# Altium schematic sheet adc084s021.SchDoc
size A; DocumentNumber: 1; SheetNumber: 1; SheetTotal: 1
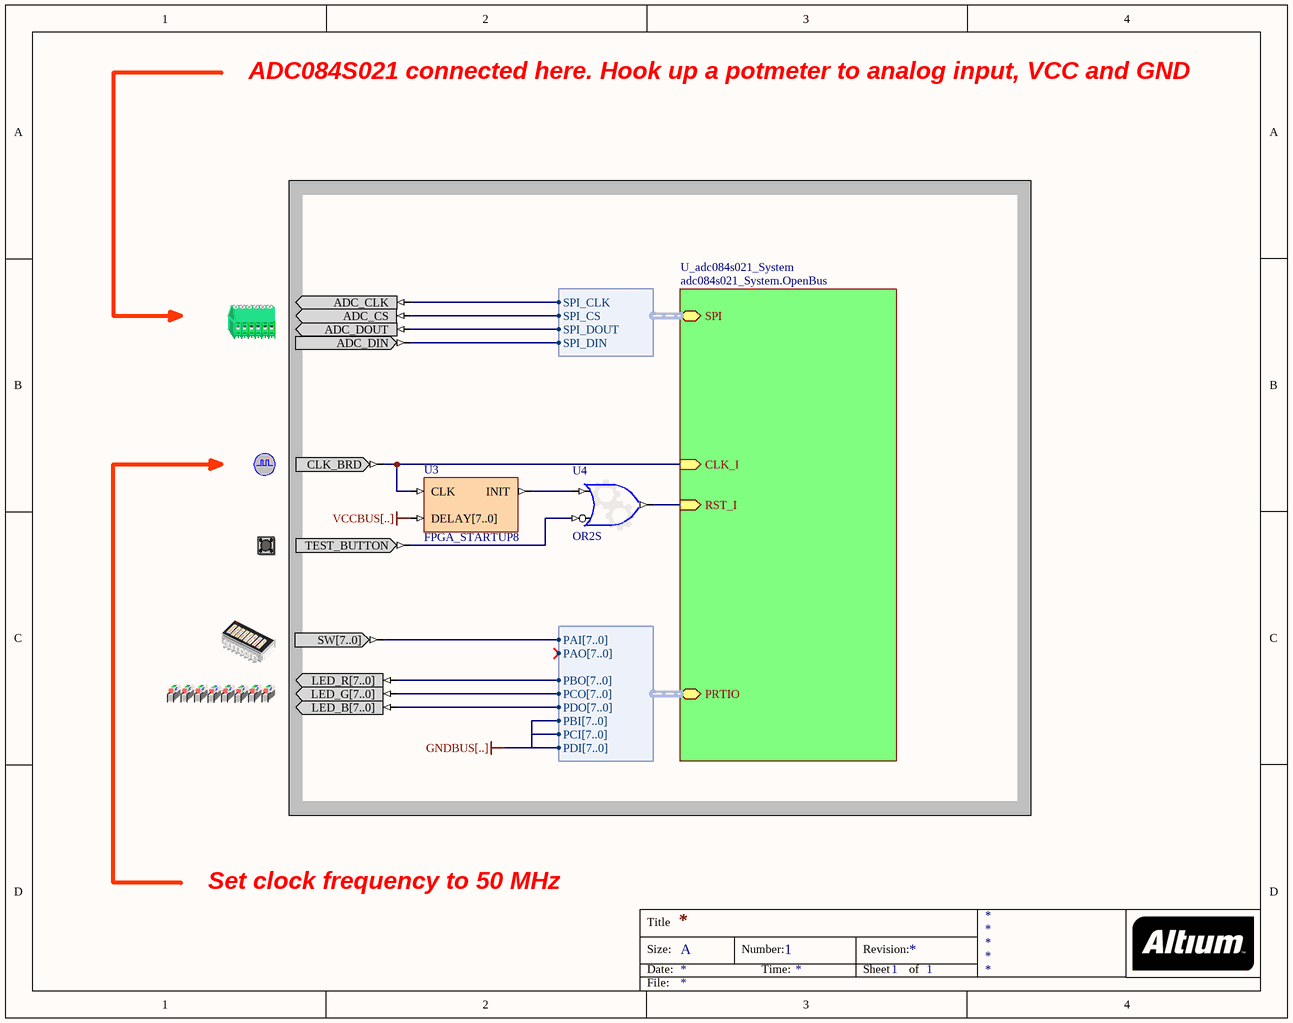
[diagram p0: adc084s021.SchDoc]

## Parts
(Parts that share a designator on the sheet are numbered #1, #2 ... from top to bottom, then left to right.)
?#1  ADC  (value not drawn)
?#2  CLOCK_BOARD  (value not drawn)
?#3  TEST_BUTTON  (value not drawn)
?#4  DIPSWITCH  (value not drawn)
?#5  LEDS_RGB  (value not drawn)
U3  FPGA_STARTUP8
U4  OR2S

## Sub-sheets
U_adc084s021_System = adc084s021_System.OpenBus: RST_I (in), CLK_I (in), PRTIO (harness WB_PRTIO_IO_4_8), SPI (harness SPI_W_NB)

## Harnesses
WB_PRTIO_IO_4_8: PAO[7..0], PAI[7..0], PBO[7..0], PBI[7..0], PCO[7..0], PCI[7..0], PDO[7..0], PDI[7..0]
SPI_W_NB: SPI_DOUT, SPI_DIN, SPI_CLK, SPI_CS

## Nets
VCCBUS[..]: U3.DELAY[7..0]
Net?#1_ADC_CLK: ?#1.ADC_CLK ; sheet U_adc084s021_System/SPI.SPI_CLK
Net?#1_ADC_CS: ?#1.ADC_CS ; sheet U_adc084s021_System/SPI.SPI_CS
Net?#1_ADC_DIN: ?#1.ADC_DIN ; sheet U_adc084s021_System/SPI.SPI_DIN
Net?#1_ADC_DOUT: ?#1.ADC_DOUT ; sheet U_adc084s021_System/SPI.SPI_DOUT
Net?#2_CLK_BRD: ?#2.CLK_BRD U3.CLK ; sheet U_adc084s021_System/CLK_I
Net?#3_TEST_BUTTON: ?#3.TEST_BUTTON U4.I1
Net?#4_SW[7..0]: ?#4.SW[7..0] ; sheet U_adc084s021_System/PRTIO.PAI[7..0]
Net?#5_LED_B[7..0]: ?#5.LED_B[7..0] ; sheet U_adc084s021_System/PRTIO.PDO[7..0]
Net?#5_LED_G[7..0]: ?#5.LED_G[7..0] ; sheet U_adc084s021_System/PRTIO.PCO[7..0]
Net?#5_LED_R[7..0]: ?#5.LED_R[7..0] ; sheet U_adc084s021_System/PRTIO.PBO[7..0]
NetU3_INIT: U3.INIT U4.I0
NetU4_O: U4.O ; sheet U_adc084s021_System/RST_I

## Notes on the sheet
- ADC084S021 connected here. Hook up a potmeter to analog input, VCC and GND
- Set clock frequency to 50 MHz
- Title
- Size:
- Date:
- A
- Number:
- Time:
- Revision:
- Sheet
- of
- File:
- (in symbol DIPSWITCH) ON; 1; 2; 3; 4; 5; 6; 7; 8

## Library data of the parts
?#1 = ADC: Digital Analog Converter; PortComponent: True; Published: 11-Mar-2009; Publisher: Altium Limited; HelpURL: https://wiki.altium.com/display/ADOH/NanoBoard+3000+-+ADC+Interface; UseInDSF: True
?#2 = CLOCK_BOARD: Global System Clock Supply; PortComponent: True; Published: 19-Nov-2003; Publisher: Altium Limited; HelpURL: https://wiki.altium.com/display/ADOH/NanoBoard+3000+-+System+Clocks; UseInDSF: True
?#3 = TEST_BUTTON: Test / Reset Button; PortComponent: True; Published: 19-Nov-2003; Publisher: Altium Limited; HelpURL: https://wiki.altium.com/display/ADOH/NanoBoard+3000+-+Test-Reset+Button
?#4 = DIPSWITCH: 8-Way Dip-Switch; PortComponent: True; Published: 19-Nov-2003; Publisher: Altium Limited; HelpURL: https://wiki.altium.com/display/ADOH/NanoBoard+3000+-+User+DIP-Switch
?#5 = LEDS_RGB: LEDS RGB; PortComponent: True; Published: 11-Mar-2009; Publisher: Altium Limited; HelpURL: https://wiki.altium.com/display/ADOH/NanoBoard+3000+-+RGB+User+LEDs
U3 = FPGA_STARTUP8: FPGA Startup With 8 Bit Delay; Published: 9-Dec-2004; Publisher: Altium Limited; HelpURL: CR0119 FPGA_STARTUPx Powerup Delay Unit.pdf; LastRevisionNo: 1.00.00; ComponentLink1Description: Core &Resource Usage; ComponentLink1URL: CR0139 FPGA Peripheral Resource Usage.pdf#page=11
U4 = GATE: Configurable Generic Gate; ConfiguratorName: GENERIC_GATE; ConfigurationParameters: {}Version[1.0]{}GateKind[OR]{}BusInput[False]{}GateInputType[Bit]{}GateOutputOption[Normal]{}BusWidth[8]{}RegisterOutputs[False]{}NegativeClockEdge[False]{}InputCount[2]{}InputInvert0[False]{}InputInvert1[True]{}; LastRevisionNo: 1.00.00; Published: 3-Sep-2008; Publisher: Altium Limited